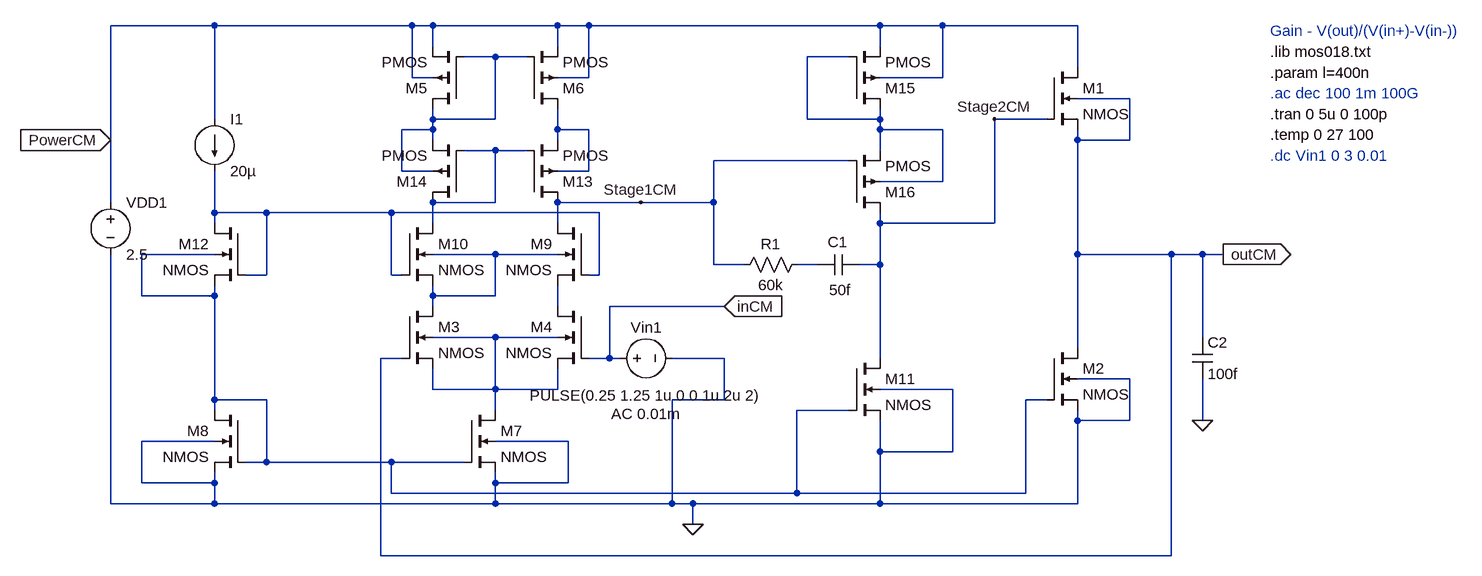
[diagram p0: schematic Slew.asc]
Slew.asc, the LTspice schematic file:
Version 4
SHEET 1 1236 680
WIRE -688 -192 -848 -192
WIRE -384 -192 -688 -192
WIRE -352 -192 -384 -192
WIRE -160 -192 -352 -192
WIRE -112 -192 -160 -192
WIRE 336 -192 -112 -192
WIRE 432 -192 336 -192
WIRE 640 -192 432 -192
WIRE -352 -160 -352 -192
WIRE -160 -160 -160 -192
WIRE 336 -160 336 -192
WIRE -256 -144 -304 -144
WIRE -208 -144 -256 -144
WIRE 288 -144 224 -144
WIRE 640 -128 640 -192
WIRE -384 -112 -384 -192
WIRE -352 -112 -384 -112
WIRE -112 -112 -112 -192
WIRE -112 -112 -160 -112
WIRE 432 -112 432 -192
WIRE 432 -112 336 -112
WIRE 720 -80 640 -80
WIRE -688 -48 -688 -192
WIRE -352 -48 -352 -64
WIRE -256 -48 -256 -144
WIRE -256 -48 -352 -48
WIRE 224 -48 224 -144
WIRE 336 -48 336 -64
WIRE 336 -48 224 -48
WIRE 592 -48 512 -48
WIRE -352 -32 -352 -48
WIRE -352 -32 -400 -32
WIRE -160 -32 -160 -64
WIRE -112 -32 -160 -32
WIRE 336 -32 336 -48
WIRE 432 -32 336 -32
WIRE -848 -16 -848 -192
WIRE -352 -16 -352 -32
WIRE -160 -16 -160 -32
WIRE 640 -16 640 -32
WIRE 720 -16 720 -80
WIRE 720 -16 640 -16
WIRE -256 0 -304 0
WIRE -208 0 -256 0
WIRE 336 0 336 -32
WIRE 288 16 80 16
WIRE -400 32 -400 -32
WIRE -352 32 -400 32
WIRE -112 32 -112 -32
WIRE -112 32 -160 32
WIRE 432 48 432 -32
WIRE 432 48 336 48
WIRE -848 80 -848 -16
WIRE -256 80 -256 0
WIRE -256 80 -352 80
WIRE -32 80 -160 80
WIRE 80 80 80 16
WIRE 80 80 -32 80
WIRE -688 96 -688 32
WIRE -608 96 -688 96
WIRE -416 96 -608 96
WIRE -96 96 -416 96
WIRE -688 112 -688 96
WIRE -352 112 -352 80
WIRE -160 112 -160 80
WIRE 336 112 336 96
WIRE 512 112 512 -48
WIRE 512 112 336 112
WIRE -688 160 -800 160
WIRE -256 160 -352 160
WIRE -160 160 -256 160
WIRE 640 160 640 -16
WIRE 784 160 640 160
WIRE 832 160 784 160
WIRE 864 160 832 160
WIRE 80 176 80 80
WIRE 128 176 80 176
WIRE 240 176 208 176
WIRE 336 176 336 112
WIRE 336 176 304 176
WIRE -608 192 -608 96
WIRE -608 192 -640 192
WIRE -416 192 -416 96
WIRE -400 192 -416 192
WIRE -96 192 -96 96
WIRE -96 192 -112 192
WIRE -800 224 -800 160
WIRE -688 224 -688 208
WIRE -688 224 -800 224
WIRE -352 224 -352 208
WIRE -256 224 -256 160
WIRE -256 224 -352 224
WIRE -352 240 -352 224
WIRE -160 240 -160 208
WIRE 96 240 -80 240
WIRE -256 288 -352 288
WIRE -160 288 -256 288
WIRE 832 288 832 160
WIRE 640 304 640 160
WIRE -400 320 -432 320
WIRE -80 320 -80 240
WIRE -80 320 -112 320
WIRE -64 320 -80 320
WIRE 96 320 16 320
WIRE 336 320 336 176
WIRE 720 352 640 352
WIRE -352 368 -352 336
WIRE -256 368 -256 288
WIRE -256 368 -352 368
WIRE -160 368 -160 336
WIRE -160 368 -256 368
WIRE 448 368 336 368
WIRE -688 384 -688 224
WIRE -608 384 -688 384
WIRE 96 384 96 320
WIRE 96 384 16 384
WIRE 592 384 560 384
WIRE -688 400 -688 384
WIRE -256 400 -256 368
WIRE 288 400 208 400
WIRE 640 416 640 400
WIRE 720 416 720 352
WIRE 720 416 640 416
WIRE 832 416 832 352
WIRE -688 448 -800 448
WIRE -144 448 -256 448
WIRE 336 464 336 416
WIRE 448 464 448 368
WIRE 448 464 336 464
WIRE -608 480 -608 384
WIRE -608 480 -640 480
WIRE -416 480 -608 480
WIRE -304 480 -416 480
WIRE -800 512 -800 448
WIRE -688 512 -688 496
WIRE -688 512 -800 512
WIRE -256 512 -256 496
WIRE -144 512 -144 448
WIRE -144 512 -256 512
WIRE -416 528 -416 480
WIRE 208 528 208 400
WIRE 208 528 -416 528
WIRE 560 528 560 384
WIRE 560 528 208 528
WIRE -848 544 -848 160
WIRE -688 544 -688 512
WIRE -688 544 -848 544
WIRE -256 544 -256 512
WIRE -256 544 -688 544
WIRE 16 544 16 384
WIRE 16 544 -256 544
WIRE 48 544 16 544
WIRE 336 544 336 464
WIRE 336 544 48 544
WIRE 640 544 640 416
WIRE 640 544 336 544
WIRE 48 576 48 544
WIRE -432 624 -432 320
WIRE 784 624 784 160
WIRE 784 624 -432 624
FLAG 864 160 outCM
IOPIN 864 160 Out
FLAG 48 576 0
FLAG 96 240 inCM
IOPIN 96 240 In
FLAG -32 80 Stage1CM
FLAG 512 -48 Stage2CM
FLAG -848 -16 PowerCM
IOPIN -848 -16 In
FLAG 832 416 0
SYMBOL nmos4 592 -128 R0
SYMATTR InstName M1
SYMATTR Value2 l={l} w=0.5u m=20
SYMBOL nmos4 592 304 R0
SYMATTR InstName M2
SYMATTR Value2 l={l} w=10u m=3
SYMBOL nmos4 -400 240 R0
SYMATTR InstName M3
SYMATTR Value2 l={l} w=0.5u m=1
SYMBOL nmos4 -112 240 M0
SYMATTR InstName M4
SYMATTR Value2 l={l} w=0.5u m=1
SYMBOL pmos4 -304 -64 R180
SYMATTR InstName M5
SYMATTR Value2 l={l} w=1u m=2
SYMBOL pmos4 -208 -64 M180
SYMATTR InstName M6
SYMATTR Value2 l={l} w=1u m=2
SYMBOL nmos4 -304 400 R0
SYMATTR InstName M7
SYMATTR Value2 l={l} w=2u
SYMBOL current -688 -48 R0
WINDOW 123 0 0 Left 0
WINDOW 39 0 0 Left 0
SYMATTR InstName I1
SYMATTR Value 20µ
SYMBOL nmos4 -640 400 M0
SYMATTR InstName M8
SYMATTR Value2 l={l} w=10u
SYMBOL voltage -848 64 R0
WINDOW 123 0 0 Left 0
WINDOW 39 0 0 Left 0
SYMATTR InstName VDD1
SYMATTR Value 2.5
SYMBOL voltage -80 320 R270
WINDOW 0 32 56 VTop 2
WINDOW 3 -42 56 VBottom 2
WINDOW 123 -70 56 VBottom 2
WINDOW 39 -1 235 VBottom 2
SYMATTR InstName Vin1
SYMATTR Value PULSE(0.25 1.25 1u 0 0 1u 2u 2)
SYMATTR Value2 AC 0.01m
SYMBOL nmos4 -112 112 M0
SYMATTR InstName M9
SYMATTR Value2 l={l} w=0.5u m=1
SYMBOL nmos4 -400 112 R0
SYMATTR InstName M10
SYMATTR Value2 l={l} w=0.5u m=1
SYMBOL nmos4 288 320 R0
SYMATTR InstName M11
SYMATTR Value2 l={l} w=1u m=5
SYMBOL cap 304 160 R90
WINDOW 0 -3 33 VBottom 2
WINDOW 3 39 29 VTop 2
SYMATTR InstName C1
SYMATTR Value 50f
SYMBOL nmos4 -640 112 M0
SYMATTR InstName M12
SYMATTR Value2 l={l} w=1u
SYMBOL pmos4 -208 80 M180
SYMATTR InstName M13
SYMATTR Value2 l={l} w=1u m=1
SYMBOL pmos4 -304 80 R180
SYMATTR InstName M14
SYMATTR Value2 l={l} w=1u m=1
SYMBOL pmos4 288 -64 M180
SYMATTR InstName M15
SYMATTR Value2 l={l} w=0.5u m=25
SYMBOL pmos4 288 96 M180
SYMATTR InstName M16
SYMATTR Value2 l={l} w=0.5u m=10
SYMBOL res 224 160 R90
WINDOW 0 0 56 VBottom 2
WINDOW 3 32 56 VTop 2
SYMATTR InstName R1
SYMATTR Value 60k
SYMBOL cap 816 288 R0
SYMATTR InstName C2
SYMATTR Value 100f
TEXT 936 -56 Left 2 !.tran 0 5u 0 100p
TEXT 936 -24 Left 2 !.temp 0 27 100
TEXT 936 -88 Left 2 ;.ac dec 100 1m 100G
TEXT 936 -120 Left 2 !.param l=400n
TEXT 936 -152 Left 2 !.lib mos018.txt
TEXT 936 -184 Left 2 ;Gain - V(out)/(V(in+)-V(in-))
TEXT 936 8 Left 2 ;.dc Vin1 0 3 0.01

The netlist it stands for:
* Slew.asc
M1 PowerCM Stage2CM outCM outCM NMOS l={l} w=0.5u m=20
M2 outCM N006 0 0 NMOS l={l} w=10u m=3
M3 N007 outCM N010 N010 NMOS l={l} w=0.5u m=1
M4 N009 inCM N010 N010 NMOS l={l} w=0.5u m=1
M5 N001 N001 PowerCM PowerCM PMOS l={l} w=1u m=2
M6 N003 N001 PowerCM PowerCM PMOS l={l} w=1u m=2
M7 N010 N006 0 0 NMOS l={l} w=2u
I1 PowerCM N005 20µ
M8 N006 N006 0 0 NMOS l={l} w=10u
VDD1 PowerCM 0 2.5
Vin1 inCM 0 PULSE(0.25 1.25 1u 0 0 1u 2u 2) AC 0.01m
M9 Stage1CM N005 N009 N007 NMOS l={l} w=0.5u m=1
M10 N004 N005 N007 N007 NMOS l={l} w=0.5u m=1
M11 Stage2CM N006 0 0 NMOS l={l} w=1u m=5
C1 Stage2CM N008 50f
M12 N005 N005 N006 N006 NMOS l={l} w=1u
M13 Stage1CM N004 N003 N003 PMOS l={l} w=1u m=1
M14 N004 N004 N001 N001 PMOS l={l} w=1u m=1
M15 N002 N002 PowerCM PowerCM PMOS l={l} w=0.5u m=25
M16 Stage2CM Stage1CM N002 N002 PMOS l={l} w=0.5u m=10
R1 N008 Stage1CM 60k
C2 outCM 0 100f
.model NMOS NMOS
.model PMOS PMOS
.lib standard.mos
.tran 0 5u 0 100p
.temp 0 27 100
* .ac dec 100 1m 100G
.param l=400n
.lib mos018.txt
* Gain - V(out)/(V(in+)-V(in-))
* .dc Vin1 0 3 0.01
.backanno
.end